# EAGLE schematic LDAQ-MOD-BREADBOARD (EAGLE 6.6.0)
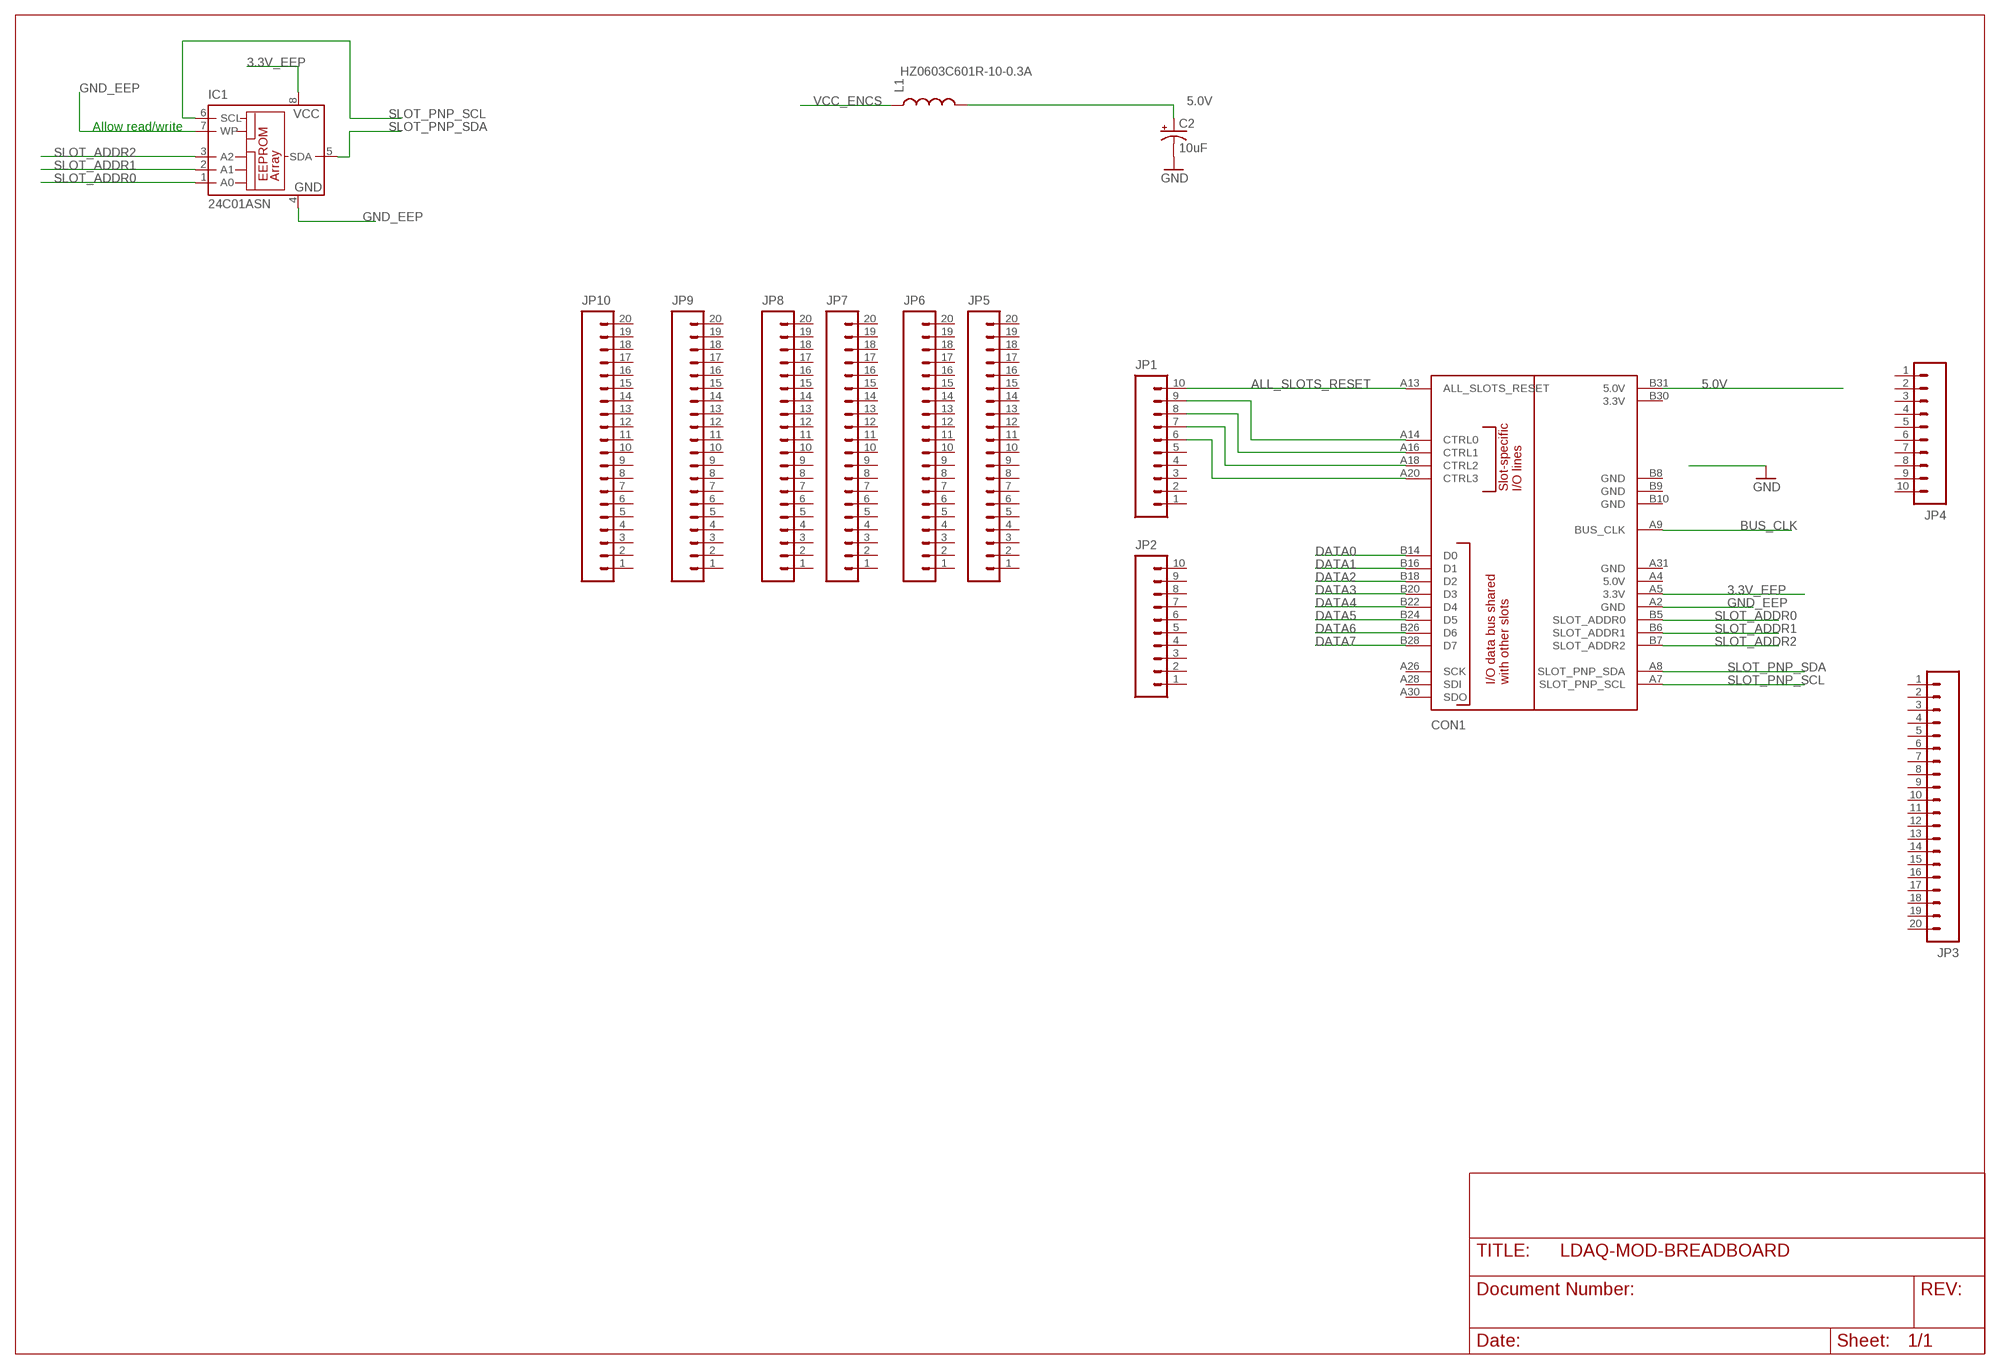
[diagram p0: schematic, sheet 1]

## Parts
C2  10uF  CAP_POL1206  [EIA3216]
CON1  BOARD  LIBREDAQ_DAUGHTER_BOARDPCIE-64_SIZE1  [PCI-E_64_EDGE_70X60]
IC1  24C01ASN  [SO-08]
JP1  M10NO_SILK_PTH_FEMALE  [1X10_NO_SILK]
JP2  M10NO_SILK_PTH_FEMALE  [1X10_NO_SILK]
JP3  M20  [1X20]
JP4  M10NO_SILK_PTH_FEMALE  [1X10_NO_SILK]
JP5  M20  [1X20]
JP6  M20  [1X20]
JP7  M20  [1X20]
JP8  M20  [1X20]
JP9  M20  [1X20]
JP10  M20  [1X20]
L1  HZ0603C601R-10-0.3A  INDUCTOR0603  [0603]

## Nets
3.3V_EEP: CON1.A5(3.3V) IC1.8(VCC)
5.0V: C2.A(+) CON1.B31(5.0V) L1.2
ALL_SLOTS_RESET: CON1.A13(ALL_SLOTS_RESET) JP1.10
BUS_CLK: CON1.A9(BUS_CLK)
DATA0: CON1.B14(D0)
DATA1: CON1.B16(D1)
DATA2: CON1.B18(D2)
DATA3: CON1.B20(D3)
DATA4: CON1.B22(D4)
DATA5: CON1.B24(D5)
DATA6: CON1.B26(D6)
DATA7: CON1.B28(D7)
GND: C2.C(-)
GND_EEP: CON1.A2(GND) IC1.4(GND) IC1.7(WP)
N$1: CON1.A14(CTRL0) JP1.9
N$2: CON1.A16(CTRL1) JP1.8
N$3: CON1.A18(CTRL2) JP1.7
N$4: CON1.A20(CTRL3) JP1.6
SLOT_ADDR0: CON1.B5(SLOT_ADDR0) IC1.1(A0)
SLOT_ADDR1: CON1.B6(SLOT_ADDR1) IC1.2(A1)
SLOT_ADDR2: CON1.B7(SLOT_ADDR2) IC1.3(A2)
SLOT_PNP_SCL: CON1.A7(SLOT_PNP_SCL) IC1.6(SCL)
SLOT_PNP_SDA: CON1.A8(SLOT_PNP_SDA) IC1.5(SDA)
VCC_ENCS: L1.1
Unconnected: CON1.A4(5.0V) CON1.A26(SCK) CON1.A28(SDI) CON1.A30(SDO) CON1.A31(GND) CON1.B8(GND) CON1.B9(GND) CON1.B10(GND) CON1.B30(3.3V) JP1.1 JP1.2 JP1.3 JP1.4 JP1.5 JP2.1 JP2.2 JP2.3 JP2.4 JP2.5 JP2.6 JP2.7 JP2.8 JP2.9 JP2.10 JP3.1 JP3.2 JP3.3 JP3.4 JP3.5 JP3.6 JP3.7 JP3.8 JP3.9 JP3.10 JP3.11 JP3.12 JP3.13 JP3.14 JP3.15 JP3.16 JP3.17 JP3.18 JP3.19 JP3.20 JP4.1 JP4.2 JP4.3 JP4.4 JP4.5 JP4.6 JP4.7 JP4.8 JP4.9 JP4.10 JP5.1 JP5.2 JP5.3 JP5.4 JP5.5 JP5.6 JP5.7 JP5.8 JP5.9 JP5.10 JP5.11 JP5.12 JP5.13 JP5.14 JP5.15 JP5.16 JP5.17 JP5.18 JP5.19 JP5.20 JP6.1 JP6.2 JP6.3 JP6.4 JP6.5 JP6.6 JP6.7 JP6.8 JP6.9 JP6.10 JP6.11 JP6.12 JP6.13 JP6.14 JP6.15 JP6.16 JP6.17 JP6.18 JP6.19 JP6.20 JP7.1 JP7.2 JP7.3 JP7.4 JP7.5 JP7.6 JP7.7 JP7.8 JP7.9 JP7.10 JP7.11 JP7.12 JP7.13 JP7.14 JP7.15 JP7.16 JP7.17 JP7.18 JP7.19 JP7.20 JP8.1 JP8.2 JP8.3 JP8.4 JP8.5 JP8.6 JP8.7 JP8.8 JP8.9 JP8.10 JP8.11 JP8.12 JP8.13 JP8.14 JP8.15 JP8.16 JP8.17 JP8.18 JP8.19 JP8.20 JP9.1 JP9.2 JP9.3 JP9.4 JP9.5 JP9.6 JP9.7 JP9.8 JP9.9 JP9.10 JP9.11 JP9.12 JP9.13 JP9.14 JP9.15 JP9.16 JP9.17 JP9.18 JP9.19 JP9.20 JP10.1 JP10.2 JP10.3 JP10.4 JP10.5 JP10.6 JP10.7 JP10.8 JP10.9 JP10.10 JP10.11 JP10.12 JP10.13 JP10.14 JP10.15 JP10.16 JP10.17 JP10.18 JP10.19 JP10.20

## Notes on the sheet
- Allow read/write

## Library data of the parts
C2 = SparkFun-Capacitors:CAP_POL: Capacitor Polarized These are standard SMD and PTH capacitors. Normally 10uF, 47uF, and 100uF in electrolytic and tantalum varieties. Always verify the external diameter of the through hole cap, it varies with capacity, voltage, and manufacturer. The EIA devices should be standard.
CON1 = libredaq-comps:LIBREDAQ_DAUGHTER_BOARD: LibreDAQ Expansion board (PCI-E form)
IC1 = libredaq-comps:24C*: Serial EEPROM 1 K/2 K/4 K; MPN: AT24C01BN-SH-B; OC_FARNELL: 1362638; OC_NEWARK: 50M3313
JP1 JP2 JP4 = SparkFun-Connectors:M10: Header 10 Standard 10-pin 0.1" header. Use with straight break away headers (SKU : PRT-00116), right angle break away headers (PRT-00553), swiss pins (PRT-00743), machine pins (PRT-00117), and female headers (PRT-00115).; PROD_ID: CONN-11563
JP3 JP5-JP10 = SparkFun-Connectors:M20: 1x20 .1" header This is just like the LOCK variant in that the holes are staggared by 5 mil, but except for the last two holes. They are not altered from the "standard" footprint layout. This is used for a special purpose on the layout of our Graphic LCD Backpack. Make sure you want to use this device before selecting it for you project!
L1 = SparkFun-Passives:INDUCTOR: Inductors Basic Inductor/Choke - 0603 and 1206. Footprints are not proven and vary greatly between part numbers. SRN6045- 33uH, 20% 1.4A SDR0403-560KL - 56uH, 10%, 500mA RMS/740mA peak